# Altium schematic sheet PROC054D_AWR_Pull_Resistors.SchDoc: PULL_UP_DOWN_1
size 558 x 431 mm; Date: Not shown in title block; ApprovedBy: Not shown in title block; CheckedBy: Not shown in title block; Author: Not shown in title block; CompanyName: Not shown in title block; DrawnBy: a0271760; Engineer: Not shown in title block; Organization: Not shown in title block; Address1: Not shown in title block; Address2: Not shown in title block; Address3: Not shown in title block; Address4: Not shown in title block; DocumentNumber: 12; Revision: Use project pAWRameter SCH_Rev; SheetNumber: 12; SheetTotal: 19; PageSetup: Record=PageOptions|CenterHorizontal=True|CenterVertical=True|PrintScale=1.00|XCorrection=1.00|YCorrection=1.00|PrintKind=0|BorderSize=5000000|LeftOffset=0|BottomOffset=0|Orientation=2|PaperLength=1000|PaperWidth=1000|Scale=100|PaperSource=15|PrintQuality=600|MediaType=1|DitherType=10|PaperKind=Letter|PrintScaleMode=1; CurrentTime: Not shown in title block; CurrentDate: Not shown in title block; Time: Not shown in title block; DocumentFullPathAndName: Not shown in title block; DocumentName: Not shown in title block; ModifiedDate: Not shown in title block; ImagePath: Not shown in title block
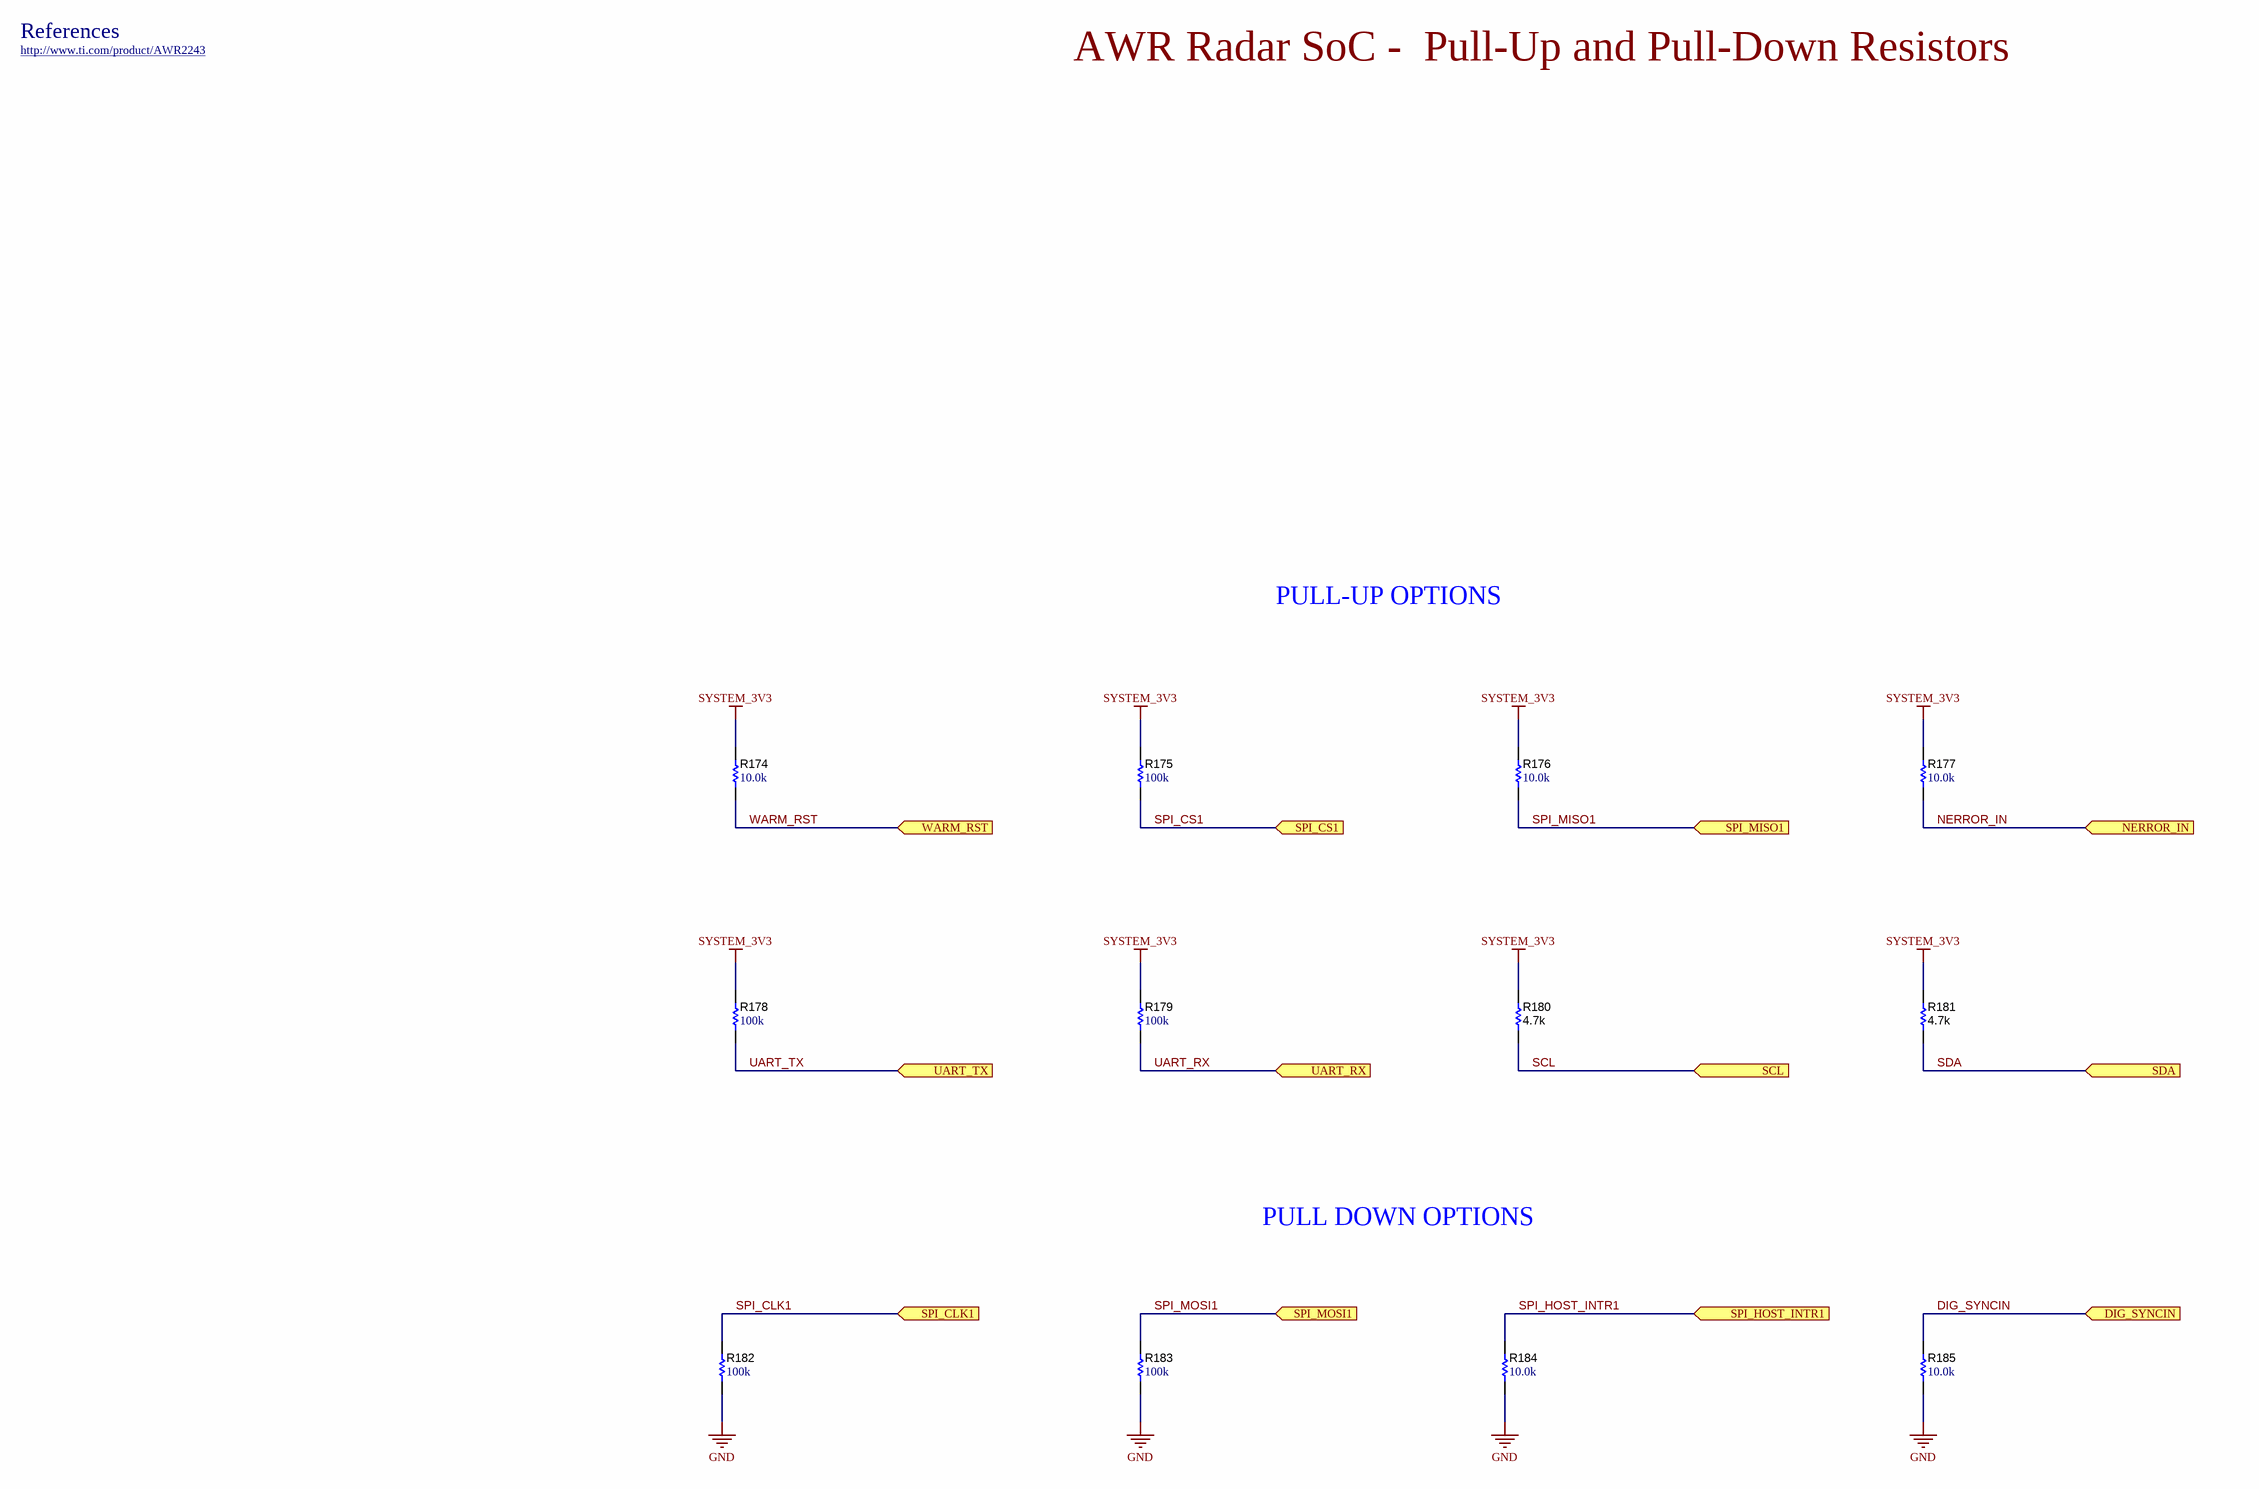
[diagram p0: PROC054D_AWR_Pull_Resistors.SchDoc]

## Parts
R174  ValueDisplayed: 10.0k  [0402]  (hidden comment: CRCW040210K0FKED)
R175  ValueDisplayed: 100k  [0402]  (hidden comment: CRCW0402100KFKED)
R176  ValueDisplayed: 10.0k  [0402]  (hidden comment: CRCW040210K0FKED)
R177  ValueDisplayed: 10.0k  [0402S]  (hidden comment: CRCW040210K0FKED)
R178  ValueDisplayed: 100k  [0402]  (hidden comment: CRCW0402100KFKED)
R179  ValueDisplayed: 100k  [0402]  (hidden comment: CRCW0402100KFKED)
R180  ValueDisplayed: 4.7k  [0402S]  (hidden comment: CRCW04024K70JNED)
R181  ValueDisplayed: 4.7k  [0402S]  (hidden comment: CRCW04024K70JNED)
R182  ValueDisplayed: 100k  [0402]  (hidden comment: CRCW0402100KFKED)
R183  ValueDisplayed: 100k  [0402]  (hidden comment: CRCW0402100KFKED)
R184  ValueDisplayed: 10.0k  [0402]  (hidden comment: CRCW040210K0FKED)
R185  ValueDisplayed: 10.0k  [0402S]  (hidden comment: CRCW040210K0FKED)

## Ports
DIG_SYNCIN (in), NERROR_IN (in), SCL (in), SDA (in), SPI_CLK1 (in), SPI_CS1 (in), SPI_HOST_INTR1 (in), SPI_MISO1 (in), SPI_MOSI1 (in), UART_RX (in), UART_TX (in), WARM_RST (in)

## Nets
GND: R182.1 R183.1 R184.1 R185.1
SYSTEM_3V3: R174.2 R175.2 R176.2 R177.2 R178.2 R179.2 R180.2 R181.2
DIG_SYNCIN: R185.2 ; port DIG_SYNCIN
NERROR_IN: R177.1 ; port NERROR_IN
SCL: R180.1 ; port SCL
SDA: R181.1 ; port SDA
SPI_CLK1: R182.2 ; port SPI_CLK1
SPI_CS1: R175.1 ; port SPI_CS1
SPI_HOST_INTR1: R184.2 ; port SPI_HOST_INTR1
SPI_MISO1: R176.1 ; port SPI_MISO1
SPI_MOSI1: R183.2 ; port SPI_MOSI1
UART_RX: R179.1 ; port UART_RX
UART_TX: R178.1 ; port UART_TX
WARM_RST: R174.1 ; port WARM_RST

## Notes on the sheet
- References
- http://www.ti.com/product/AWR2243
- AWR Radar SoC -  Pull-Up and Pull-Down Resistors
- PULL-UP OPTIONS
- PULL DOWN OPTIONS
- Drawn By:
- SVN Rev:
- Number:
- TID #:
- Orderable:
- Rev:
- Sheet Title:
- File:
- Project Title:
- Designed for:
- Assembly VAWRiant:
- Mod. Date:
- Sheet:
- Size:
- of
- C
- http://www.ti.com
- Texas Instruments and/or its licensors do not wAWRrant the accuracy or completeness of this specification or any information contained therein. Texas Instruments and/or its licensors do not wAWRrant that this design will meet the specifications, will be suitable for your application or fit for any pAWRticulAWR purpose, or will operate in an implementation. Texas Instruments and/or its licensors do not wAWRrant that the design is production worthy. You should completely validate and test your design implementation to confirm the system functionality for your application.
- Engineer:
- Contact:
- © Texas Instruments

## Library data of the parts
R174 R176 R177 R184 R185 = CMP-0025958-3: RES, 10.0 k, 1%, 0.063 W, AEC-Q200 Grade 0, 0402; Manufacturer: Vishay-Dale; Power_W: 63mW; TempCo: 100 ppm/C; Value_Code: 10k0; Value: 10.0k; EIA_Code: E96; Res_ohm: 10k; SizeX_mm: 1; SizeY_mm: 0.5; SizeZ_mm: 0.6; Value2: 0.063W; AEC Qualified: Y; VDC_V: 50V; AEC Category: Q200; AEC Grade: 0; Supplier Part Number 2: 52K6595; Supplier 2: Newark; Supplier Part Number 3: 71-CRCW0402-10K-E3; Supplier 3: Mouser; RoHS: E; Value1: 1%; MountType: SMT; Supplier 1: Digi-Key; PackageReference: 0402; Tolerance_%: 1%; SizeArea_mm2: 0.5; CompType: Resistor; PartNumber: CRCW040210K0FKED; ComponentLink1Description: Datasheet link; Supplier Part Number 1: 541-10.0KLCT-ND; Technology: Thick Film; ComponentLink1URL: http://www.vishay.com/docs/20035/dcrcwe3.pdf
R175 R178 R179 R182 R183 = CMP-0025950-3: RES, 100 k, 1%, 0.063 W, AEC-Q200 Grade 0, 0402; Manufacturer: Vishay-Dale; Power_W: 63mW; TempCo: 100 ppm/C; Value: 100k; EIA_Code: E96; SizeX_mm: 1; SizeY_mm: 0.5; SizeZ_mm: 0.6; Value2: 0.063W; AEC Qualified: Y; VDC_V: 50V; AEC Category: Q200; AEC Grade: 0; Supplier Part Number 2: 52K6607; Supplier 2: Newark; Supplier Part Number 3: 71-CRCW0402-100K-E3; Supplier 3: Mouser; Value_Code: 100k; RoHS: E; Value1: 1%; MountType: SMT; Supplier 1: Digi-Key; PackageReference: 0402; Tolerance_%: 1%; Res_ohm: 100k; SizeArea_mm2: 0.5; CompType: Resistor; PartNumber: CRCW0402100KFKED; ComponentLink1Description: Datasheet link; Supplier Part Number 1: 541-100KLCT-ND; Technology: Thick Film; ComponentLink1URL: http://www.vishay.com/docs/20035/dcrcwe3.pdf
R180 R181 = CMP-0026938-5: RES, 4.7 k, 5%, 0.063 W, AEC-Q200 Grade 0, 0402; Manufacturer: Vishay-Dale; Power_W: 63mW; TempCo: 200 ppm/C; Value_Code: 4k70; Value: 4.7k; EIA_Code: E24; SizeX_mm: 1; SizeY_mm: 0.5; SizeZ_mm: 0.6; Value2: 0.063W; AEC Qualified: Y; VDC_V: 50V; AEC Category: Q200; AEC Grade: 0; Supplier Part Number 2: 59M6733; Supplier 2: Newark; Supplier Part Number 3: 71-CRCW0402J-4.7K-E3; Supplier 3: Mouser; RoHS: E; Value1: 5%; MountType: SMT; Supplier 1: Digi-Key; PackageReference: 0402; Tolerance_%: 5%; Res_ohm: 4.7k; SizeArea_mm2: 0.5; CompType: Resistor; PartNumber: CRCW04024K70JNED; ComponentLink1Description: Datasheet link; Supplier Part Number 1: 541-4.7KJCT-ND; Technology: Thick Film; ComponentLink1URL: http://www.vishay.com/docs/20035/dcrcwe3.pdf